# EAGLE design PB-Interface (EAGLE 9.6.2)
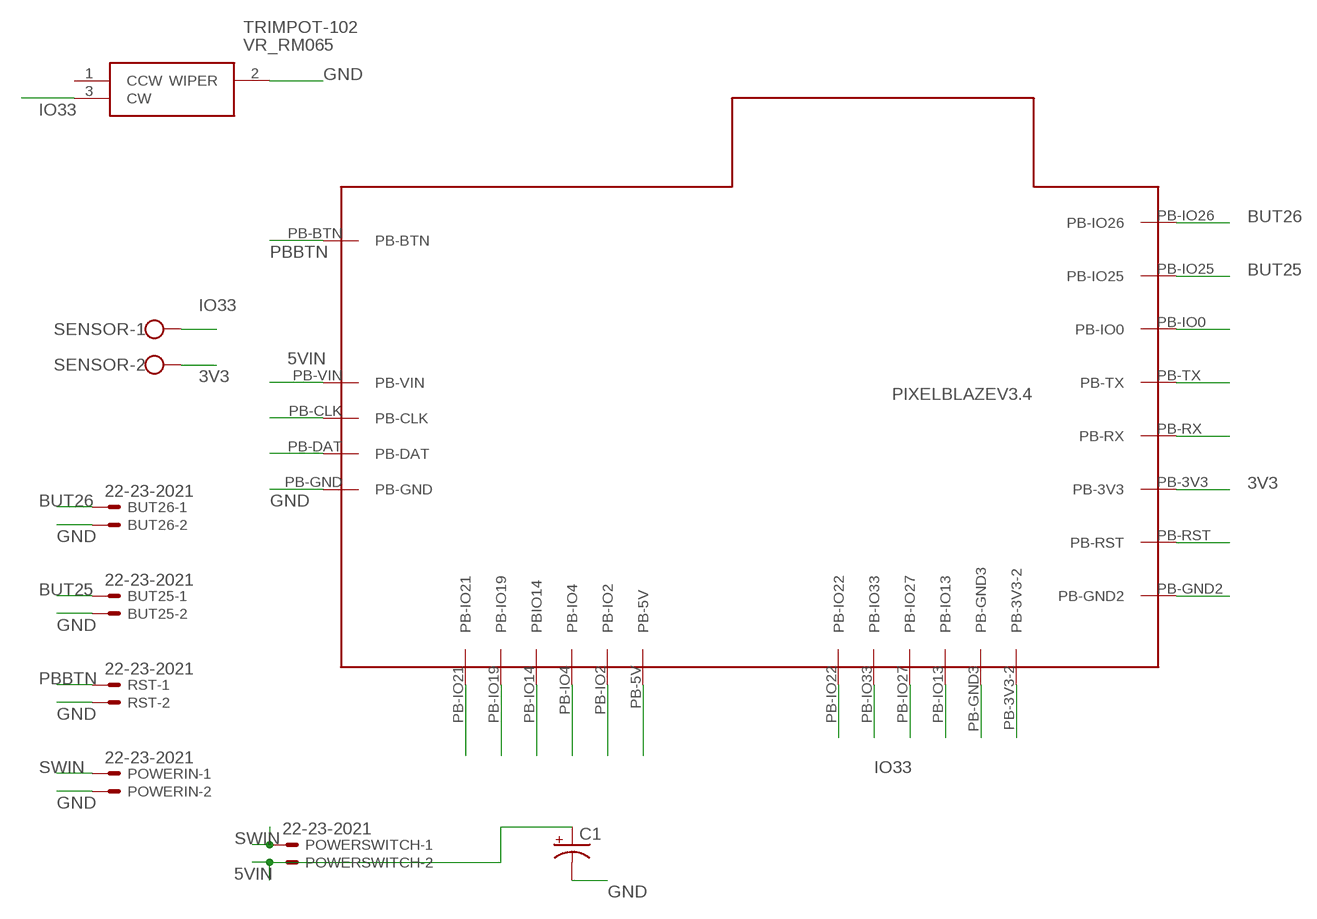
[diagram p0: schematic, sheet 1]

## Parts
BUT25  22-23-2021  [22-23-2021]
BUT26  22-23-2021  [22-23-2021]
C1  CPOL-USE5-10.5  [E5-10,5]
PIXELBLAZEV3.4  PIXELBLAZE-V3.4  [PIXELBLAZE-V3]
POWERIN  22-23-2021  [22-23-2021]
POWERSWITCH  22-23-2021  [22-23-2021]
RST  22-23-2021  [22-23-2021]
SENSOR  W237-102  [W237-102]
TRIMPOT-102  VR_RM065  [VRRM065]

## Nets
3V3: PIXELBLAZEV3.4.PB-3V3 SENSOR.2
5VIN: C1.+ PIXELBLAZEV3.4.PB-VIN POWERSWITCH.2
BUT25: BUT25.1 PIXELBLAZEV3.4.PB-IO25
BUT26: BUT26.1 PIXELBLAZEV3.4.PB-IO26
GND: BUT25.2 BUT26.2 C1.- PIXELBLAZEV3.4.PB-GND POWERIN.2 RST.2 TRIMPOT-102.2(WIPER)
IO33: PIXELBLAZEV3.4.PB-IO33 SENSOR.1 TRIMPOT-102.3(CW)
N$15: PIXELBLAZEV3.4.PB-CLK
N$16: PIXELBLAZEV3.4.PB-DAT
N$18: PIXELBLAZEV3.4.PB-IO21
N$19: PIXELBLAZEV3.4.PB-IO19
N$20: PIXELBLAZEV3.4.PB-IO14(PBIO14)
N$21: PIXELBLAZEV3.4.PB-IO4
N$22: PIXELBLAZEV3.4.PB-IO2
N$23: PIXELBLAZEV3.4.PB-5V
N$24: PIXELBLAZEV3.4.PB-IO22
N$26: PIXELBLAZEV3.4.PB-IO27
N$27: PIXELBLAZEV3.4.PB-IO13
N$28: PIXELBLAZEV3.4.PB-GND3
N$29: PIXELBLAZEV3.4.PB-3V3-2
N$30: PIXELBLAZEV3.4.PB-GND2
N$31: PIXELBLAZEV3.4.PB-RST
N$33: PIXELBLAZEV3.4.PB-RX
N$34: PIXELBLAZEV3.4.PB-TX
N$35: PIXELBLAZEV3.4.PB-IO0
PBBTN: PIXELBLAZEV3.4.PB-BTN RST.1
SWIN: POWERIN.1 POWERSWITCH.1
Unconnected: TRIMPOT-102.1(CCW)

## Library data of the parts
BUT25 BUT26 POWERIN POWERSWITCH RST = con-molex:22-23-2021: .100" (2.54mm) Center Header - 2 Pin; MF: MOLEX; MPN: 22-23-2021; OC_FARNELL: 1462926; OC_NEWARK: 25C3832
C1 = rcl:CPOL-US: POLARIZED CAPACITOR, American symbol; SPICEPREFIX: C
PIXELBLAZEV3.4 = PBv3:PIXELBLAZE-V3.4
SENSOR = con-wago-500:W237-102: WAGO SCREW CLAMP; MPN: 237-102; OC_FARNELL: unknown; OC_NEWARK: 70K9898
TRIMPOT-102 = VR_RM065:VR_RM065: CARBON FILM POTENTIOMETER Source: Datasheet <https://www.dipmicro.com/?datasheet=RM065.pdf>; DESCRIPTION: CARBON FILM POTENTIOMETER; HEIGHT: 7.5mm; MANUFACTURER_NAME: Runtron; MANUFACTURER_PART_NUMBER: VR RM065

## Board
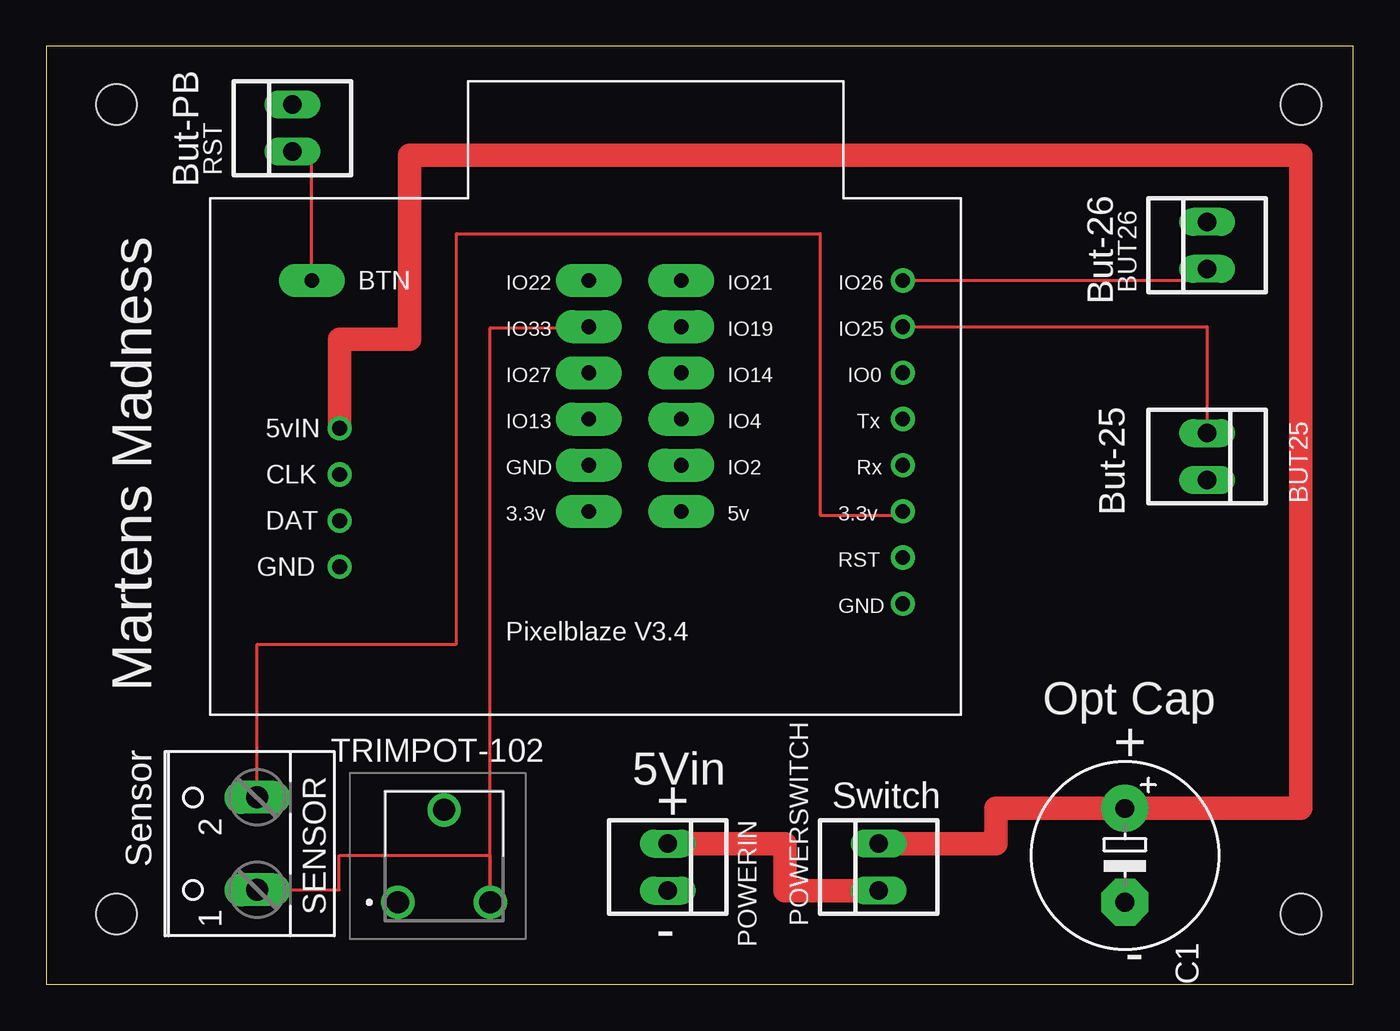
[diagram p1: board, top side]
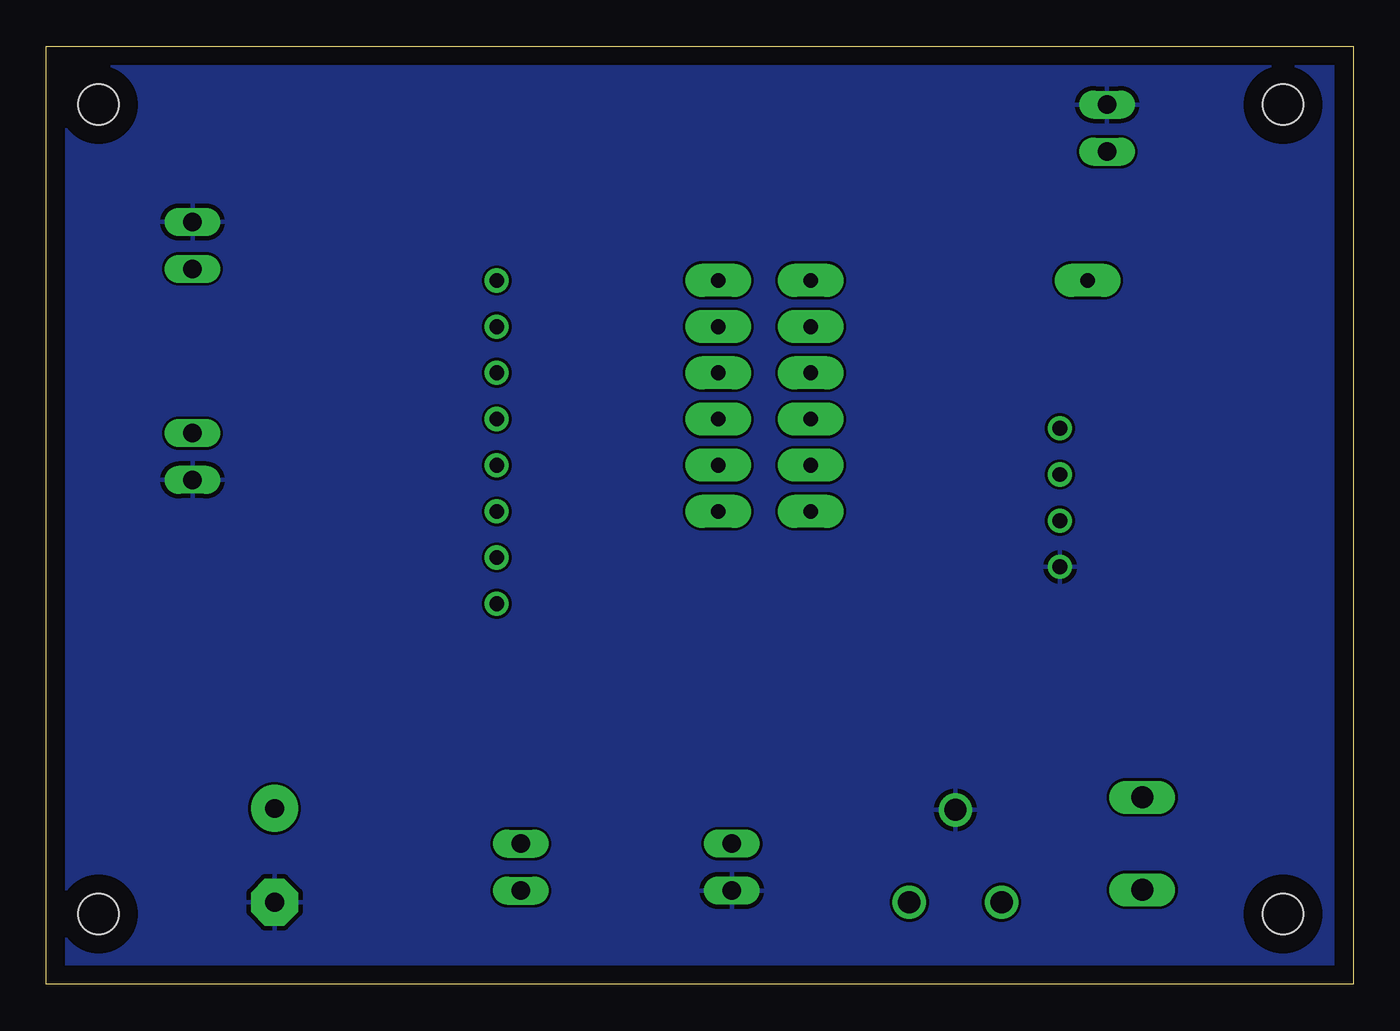
[diagram p2: board, bottom side, seen from below]

Size 70.79 x 50.79 mm. Coordinates in mm from the lower left corner, seen from the top.
Outline: 0,0 70.79,0 70.79,50.79 0,50.79 0,0
Copper layers (1*16): Top 0.035mm / dielectric 1.5mm / Bottom 0.035mm
Design rules "default": minimum track width 6mil, minimum drill 0.35mm, track to track 6mil, track to pad 6mil, pad to pad 6mil, via to via 6mil, smd to smd 6mil, copper to edge 40mil, drill to drill 6mil, minimum pad ring 10mil, minimum via ring 8mil, stop-mask expansion 4mil, vias tented up to drill 0mil, thermal gap 10mil
Holes 2.2 mm at 3.81,3.81 3.81,47.62 67.94,3.81 67.94,47.62

### Footprints (pad centres in the part's own frame; a part is rotated, then mirrored left to right if it is on the bottom)
22-23-2021 = drill 1 long: 1 -1.27,0; 2 1.27,0
E5-10,5 = drill 1.016 pad 2.54: + -2.54,0 | drill 1.016 pad 2.54 octagon: - 2.54,0
PIXELBLAZE-V3 = drill 0.8: PB-3V3 37.5,11; PB-CLK 7,13; PB-DAT 7,10.5; PB-GND 7,8; PB-GND2 37.5,6; PB-IO0 37.5,18.5; PB-IO25 37.5,21; PB-IO26 37.5,23.5; PB-RST 37.5,8.5; PB-RX 37.5,13.5; PB-TX 37.5,16; PB-VIN 7,15.5 | drill 0.8 pad 1.778 long: PB-3V3-2 20.5,11; PB-5V 25.5,11; PB-BTN 5.5,23.5; PB-GND3 20.5,13.5; PB-IO2 25.5,13.5; PB-IO4 25.5,16; PB-IO13 20.5,16; PB-IO14 25.5,18.5; PB-IO19 25.5,21; PB-IO21 25.5,23.5; PB-IO22 20.5,23.5; PB-IO27 20.5,18.5; PB-IO33 20.5,21
W237-102 = drill 1.194 long: 1 -2.5,-1.27; 2 2.5,-1.27
VRRM065 = drill 1.2 pad 1.8: 1 0,0; 2 2.5,5; 3 5,0

### Placement (x,y rotation side)
BUT25  62.87,28.57 270 top
BUT26  62.87,40.01 90 top
C1  58.42,6.99 270 top
PIXELBLAZEV3.4  8.89,14.61 0 top
POWERIN  33.66,6.35 270 top
POWERSWITCH  45.09,6.35 90 top
RST  13.34,46.35 90 top
SENSOR  10.16,7.62 90 top
TRIMPOT-102  19.05,4.45 0 top

### Tracks (layer width: path | path; a pad name or v marks a point on that pad's centre or on a via)
3V3
  Top 0.152: SENSOR.2 11.43,18.41 22.23,18.41 22.23,40.64 41.91,40.64 41.91,25.4 46.39,25.4 PIXELBLAZEV3.4.PB-3V3
5VIN
  Top 1.27: PIXELBLAZEV3.4.PB-VIN 15.89,34.92 19.68,34.92 19.68,44.87 67.94,44.87 67.94,9.53 C1.+ 51.44,9.53 51.44,7.62 POWERSWITCH.2
BUT25
  Top 0.152: PIXELBLAZEV3.4.PB-IO25 62.87,35.6 BUT25.1
BUT26
  Top 0.152: PIXELBLAZEV3.4.PB-IO26 62.87,38.1 BUT26.1
GND
  pour Bottom: 0,0 0,50.8 71.12,50.8 71.12,0
IO33
  Top 0.152: SENSOR.1 15.88,5.12 15.88,6.99 24.05,6.99 TRIMPOT-102.3 24.05,35.56 29.39,35.56 PIXELBLAZEV3.4.PB-IO33
PBBTN
  Top 0.152: PIXELBLAZEV3.4.PB-BTN 14.39,45.09 RST.1
SWIN
  Top 1.27: POWERIN.1 40.01,7.62 40.01,5.08 POWERSWITCH.1

### Text on the board
tPlace: But-PB | But-26 | But-25 | Martens Madness | Opt Cap | + | 5Vin | Switch | + | Sensor | - | -